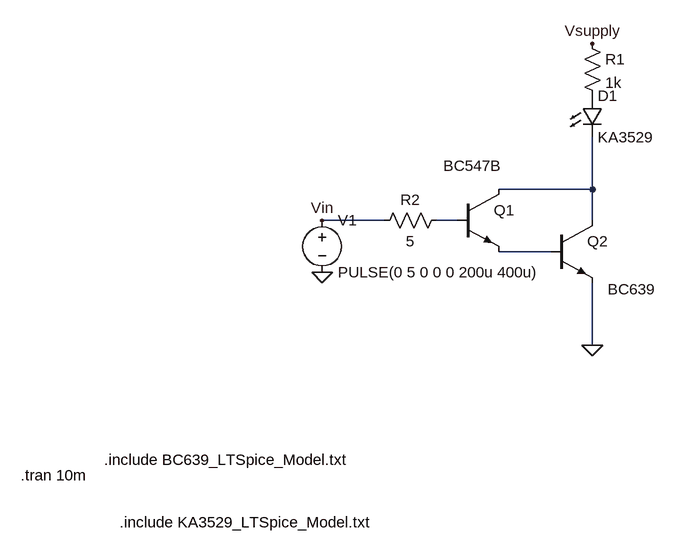
[diagram p0: schematic new led driver.asc]
new led driver.asc, the LTspice schematic file:
Version 4
SHEET 1 1576 680
WIRE 592 -16 592 -96
WIRE 592 -16 448 -16
WIRE 272 32 176 32
WIRE 384 32 352 32
WIRE 592 32 592 -16
WIRE 528 80 448 80
WIRE 592 224 592 128
FLAG 592 224 0
FLAG 592 -240 Vsupply
FLAG 176 32 Vin
FLAG 176 112 0
SYMBOL npn2 384 -16 R0
WINDOW 3 -21 -36 Left 2
SYMATTR InstName Q1
SYMATTR Value BC547B
SYMBOL npn 528 32 R0
WINDOW 3 88 106 Left 2
SYMATTR InstName Q2
SYMATTR Value BC639
SYMBOL LED 576 -160 R0
SYMATTR InstName D1
SYMATTR Value KA3529
SYMBOL res 576 -256 R0
SYMATTR InstName R1
SYMATTR Value 1k
SYMBOL res 368 16 R90
WINDOW 0 0 56 VBottom 2
WINDOW 3 32 56 VTop 2
SYMATTR InstName R2
SYMATTR Value 5
SYMBOL voltage 176 16 R0
WINDOW 123 0 0 Left 0
WINDOW 39 0 0 Left 0
SYMATTR InstName V1
SYMATTR Value PULSE(0 5 0 0 0 200u 400u)
TEXT -160 400 Left 2 !.include BC639_LTSpice_Model.txt
TEXT -288 424 Left 2 !.tran 10m
TEXT -136 496 Left 2 !.include KA3529_LTSpice_Model.txt

The netlist it stands for:
* new led driver.asc
Q1 N001 N002 N003 0 BC547B
Q2 N001 N003 0 0 BC639
D1 P001 N001 KA3529
R1 Vsupply P001 1k
R2 N002 Vin 5
V1 Vin 0 PULSE(0 5 0 0 0 200u 400u)
.model D D
.lib standard.dio
.model NPN NPN
.model PNP PNP
.lib standard.bjt
.include BC639_LTSpice_Model.txt
.tran 10m
.include KA3529_LTSpice_Model.txt
.backanno
.end

* Results of the author's LTspice run, read from the files saved beside the schematic
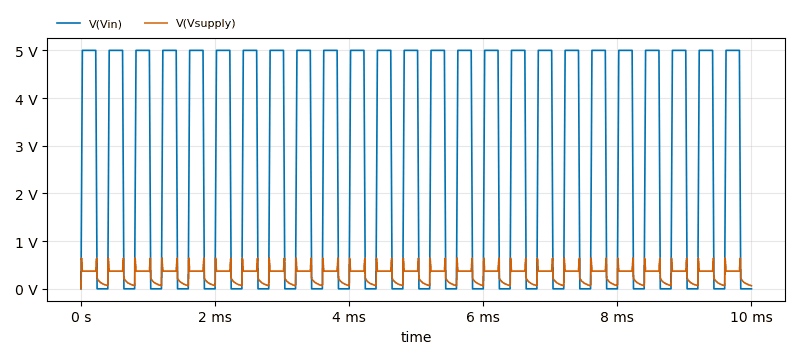
[diagram p1: Transient Analysis of new led driver.asc, plotted from the saved traces]
* Transient Analysis, 1 run:
*   V(Vin): min 0 V, max 5 V, average 2.75 V, rms 3.652 V, last 0 V
*   V(Vsupply): min 0 V, max 644.8 mV, average 279.8 mV, rms 315.4 mV, last 65.59 mV